# Altium schematic sheet Solar Tracker.SchDoc: Solar Tracker
size A4; SheetNumber: 1; SheetTotal: 3
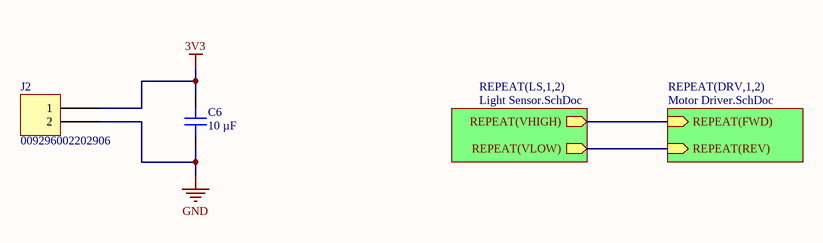
[diagram p0: Solar Tracker.SchDoc]

## Parts
C6  10 µF  [CAP 1210_3225 - 1MM]
J2  009296002202906  [AVX 9296002202806]

## Sub-sheets
REPEAT(DRV,1,2) = Motor Driver.SchDoc: REPEAT(FWD) (in), REPEAT(REV) (in)
REPEAT(LS,1,2) = Light Sensor.SchDoc: REPEAT(VHIGH) (out), REPEAT(VLOW) (out)

## Nets
3V3: C6.2 J2.1
GND: C6.1 J2.2
(unnamed): sheet REPEAT(LS,1,2)/REPEAT(VHIGH), sheet REPEAT(DRV,1,2)/REPEAT(FWD)
(unnamed): sheet REPEAT(LS,1,2)/REPEAT(VLOW), sheet REPEAT(DRV,1,2)/REPEAT(REV)

## Notes on the sheet
- Title
- Size:
- Date:
- A4
- Number:
- Time:
- Revision:
- Sheet
- of
- File:

## Library data of the parts
C6 = CL32A106MOJNNNE: CAP CER 10UF 16V X5R 1210; manufacturer: Samsung Electro-Mechanics; Tolerance: ±20%; Part Number: CL32A106MOJNNNE; Value: 10 µF; Applications: General Purpose; Capacitance: 10 µF; componentlink1description: Datasheet; componentlink1url: http://www.samsungsem.com/kr/support/product-search/mlcc/CL32A106MOJNNNE.jsp; componentlink2description: DigiKey Link; componentlink2url: https://www.digikey.com/en/products/detail/samsung-electro-mechanics/CL32A106MOJNNNE/3888522; Device Package: 1210 (3225 Metric); lastupdated: 03/03/2022 14:36:33; Lifecycle Status: Active; Minimum Order: 1; Mounting Type: Surface Mount, MLCC; Operating Temperature: -55°C ~ 85°C; Package / Case: 1210 (3225 Metric); packaging: TapeAndReel; partid: 23713; Part Status: Active; price: 0.07; series: CL; Size / Dimension: 0.126" L x 0.098" W (3.20mm x 2.50mm); Supplier 1: DigiKey; Supplier Part Number 1: 1276-2864-1-ND; Temperature Coefficient: X5R; Thickness (Max): 0.106" (2.70mm); Voltage - Rated: 16V
J2 = 009296002202906: CONN WIRE POKE-IN 2POS SMD RA; Manufacturer: AVX Corporation; Board-Side Pitch: 0.118" (3.00mm); Connector Type: Individual Wires; Number of Positions: 2; Wire Gauge: 20-26 AWG; Part Number: 009296002202906; Cable Pitch: 0.118" (3.00mm); Cable Termination: Poke-In; Color: White; ComponentLink1Description: Datasheet; ComponentLink1URL: http://datasheets.avx.com/PHLPHorizontal_00-9296.pdf; ComponentLink2Description: DigiKey Link; ComponentLink2URL: http://digikey.com/product-detail/en/avx-corporation/009296002202906/478-9533-1-ND/5161727; Contact Finish: Tin; Features: Closed End; LastUpdated: 01/05/2020 07:29:21; Lifecycle Status: Active; Minimum Order: 1; Mounting Type: Surface Mount, Right Angle; Number of Rows: 1; Packaging: TapeAndReel; Part Status: Active; Price: 0.23; Series: 9296; Supplier 1: DigiKey; Supplier Part Number 1: 478-9533-1-ND